# Altium schematic sheet Option_Nand_Flash.SchDoc
size 297 x 209 mm
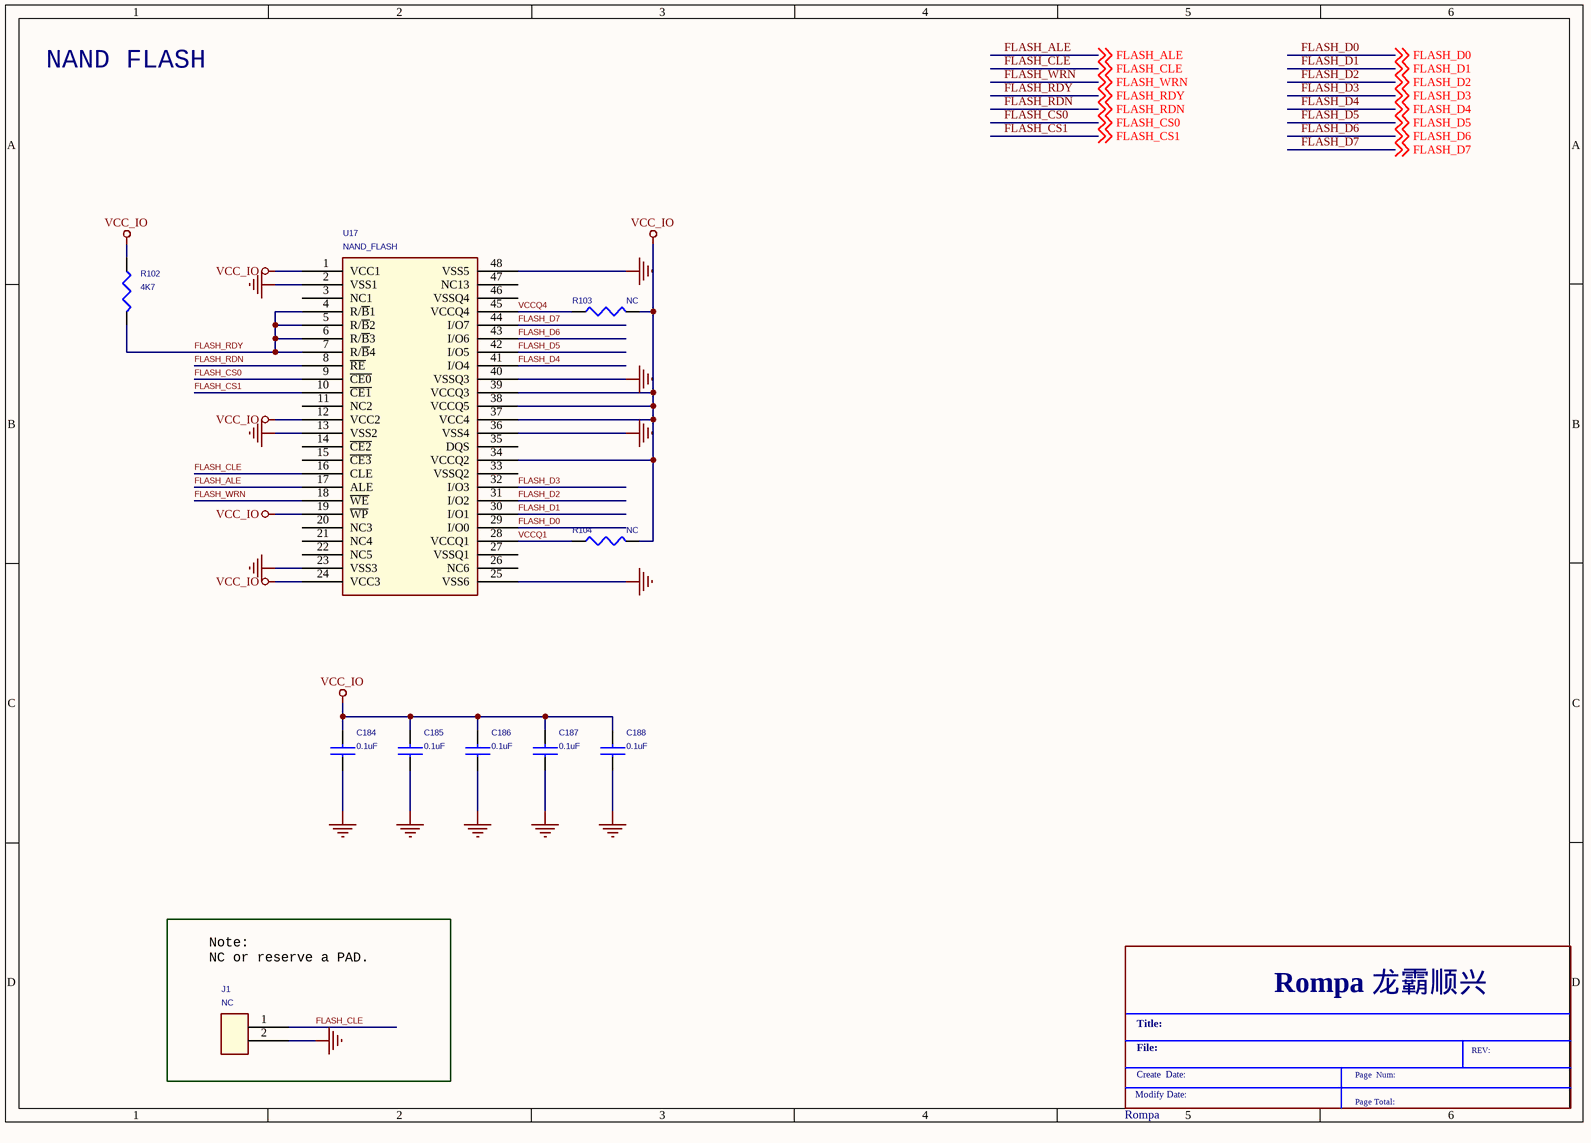
[diagram p0: Option_Nand_Flash.SchDoc]

## Parts
*  Rompa  (graphical)
C184  0.1uF  [C0402]
C185  0.1uF  [C0402]
C186  0.1uF  [C0402]
C187  0.1uF  [C0402]
C188  0.1uF  [C0402]
J1  NC  [R0603]
R102  4K7  [R0402]
R103  NC  [R0402]
R104  NC  [R0402]
U17  NAND_FLASH  [TSOP1-48]

## Nets
GND: C184.1 C185.1 C186.1 C187.1 C188.1 J1.2 U17.2(VSS1) U17.13(VSS2) U17.23(VSS3) U17.25(VSS6) U17.36(VSS4) U17.40(VSSQ3) U17.48(VSS5)
VCC_IO: C184.2 C185.2 C186.2 C187.2 C188.2 R102.1 R103.2 R104.2 U17.1(VCC1) U17.12(VCC2) U17.19(~{WP}) U17.24(VCC3) U17.34(VCCQ2) U17.37(VCC4) U17.38(VCCQ5) U17.39(VCCQ3)
FLASH_ALE: U17.17(ALE) ; off-sheet FLASH_ALE
FLASH_CLE: J1.1 U17.16(CLE) ; off-sheet FLASH_CLE
FLASH_CS0: U17.9(~{CE0}) ; off-sheet FLASH_CS0
FLASH_CS1: U17.10(~{CE1}) ; off-sheet FLASH_CS1
FLASH_D0: U17.29(I/O0) ; off-sheet FLASH_D0
FLASH_D1: U17.30(I/O1) ; off-sheet FLASH_D1
FLASH_D2: U17.31(I/O2) ; off-sheet FLASH_D2
FLASH_D3: U17.32(I/O3) ; off-sheet FLASH_D3
FLASH_D4: U17.41(I/O4) ; off-sheet FLASH_D4
FLASH_D5: U17.42(I/O5) ; off-sheet FLASH_D5
FLASH_D6: U17.43(I/O6) ; off-sheet FLASH_D6
FLASH_D7: U17.44(I/O7) ; off-sheet FLASH_D7
FLASH_RDN: U17.8(~{RE}) ; off-sheet FLASH_RDN
FLASH_RDY: R102.2 U17.4(R/~{B}1) U17.5(R/~{B}2) U17.6(R/~{B}3) U17.7(R/~{B}4) ; off-sheet FLASH_RDY
FLASH_WRN: U17.18(~{WE}) ; off-sheet FLASH_WRN
VCCQ1: R104.1 U17.28(VCCQ1)
VCCQ4: R103.1 U17.45(VCCQ4)

Not connected (* = marked no-connect by the designer): U17 3(NC1) 11(NC2) 14(~{CE2}) 15(~{CE3}) 20(NC3) 21(NC4) 22(NC5) 26(NC6) 27(VSSQ1) 33(VSSQ2) 35(DQS) 46(VSSQ4) 47(NC13)

## Notes on the sheet
- NAND FLASH
- (near J1) Note:
  NC or reserve a PAD.
- (in symbol Rompa) Rompa 龙霸顺兴; Title:; File:; REV:; Create  Date:; Page  Num:; Modify Date:; Page Total:

## Library data of the parts
C184-C188 = CAP NP: RoHS CHIP CAP 0.1uF +10/-10% X7R
J1 = CON2: TEST
R102-R104 = RES 1B: ROHS CHIP RES 4.7K 1/16W 5%
U17 = NANDFLASH_0: NAND Flash,2.7V,3.3V,3.6V,2G*8,N/A,-40℃~85℃,TSOP-48P